# Altium schematic sheet ext_power.SchDoc: External power
size A4; Organization: GPA Robotics; DocumentNumber: 11; Revision: REV 0; SheetNumber: 11; SheetTotal: 11
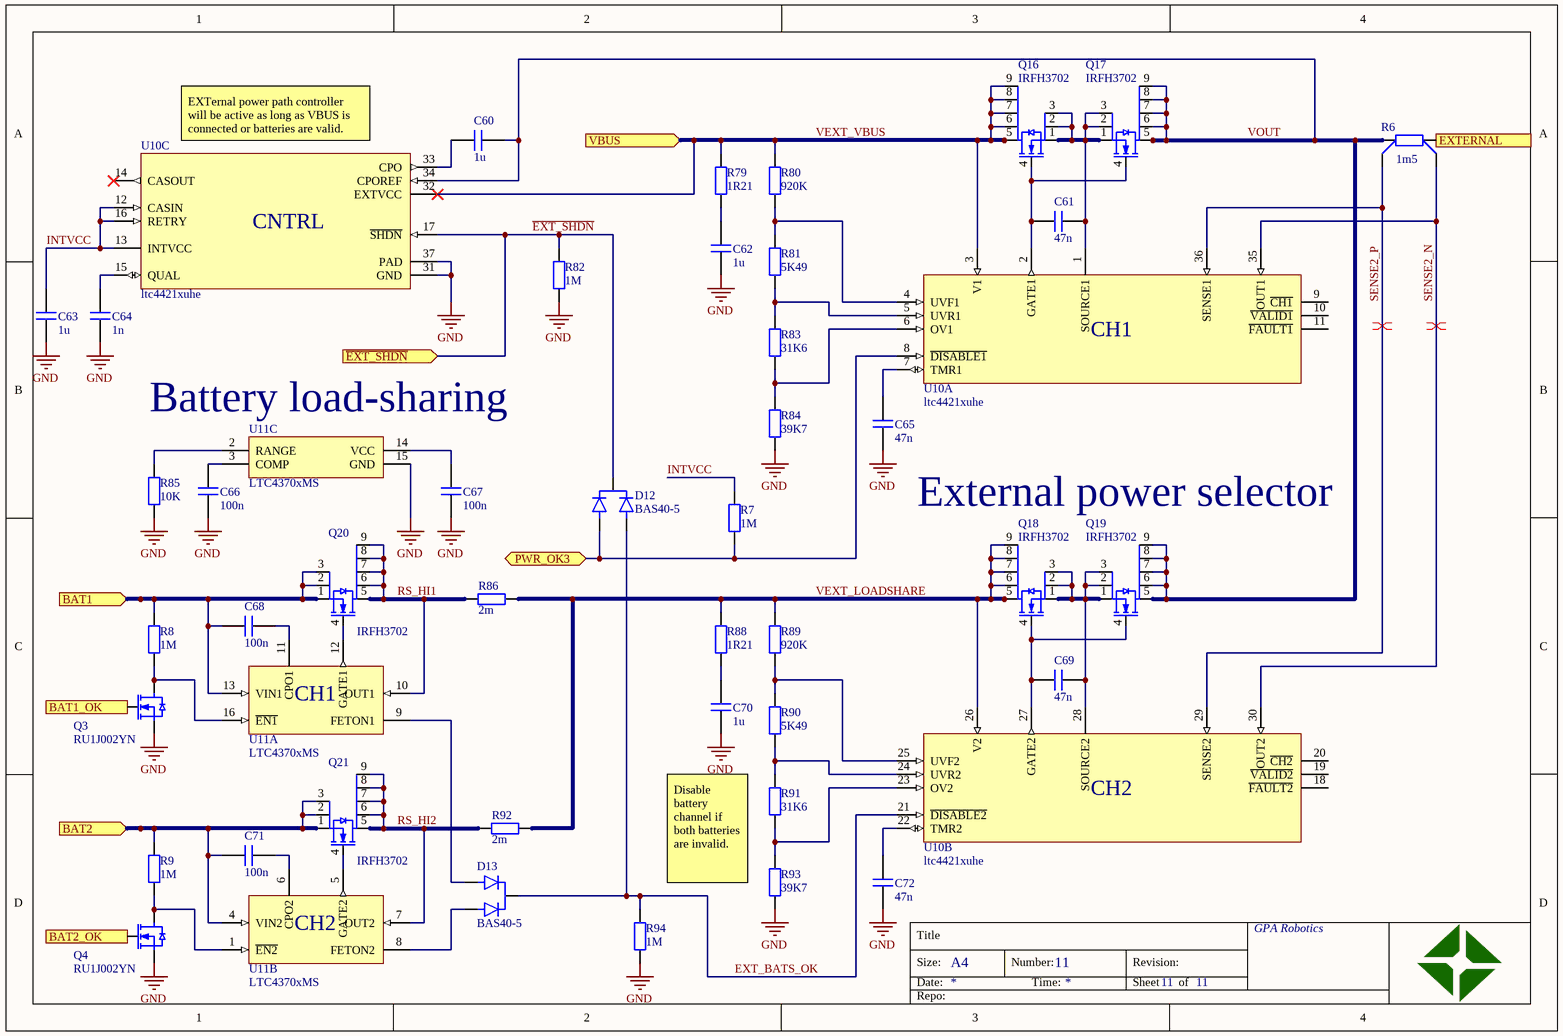
[diagram p0: ext_power.SchDoc]

## Parts
C60  value 1u  [CAPC2012X11N]  (hidden comment: cap)
C61  value 47n  [CAPC1005X06N]  (hidden comment: cap)
C62  value 1u  [CAPC2012X11N]  (hidden comment: cap)
C63  value 1u  [CAPC2012X11N]  (hidden comment: cap)
C64  value 1n  [CAPC1005X06N]  (hidden comment: cap)
C65  value 47n  [CAPC1005X06N]  (hidden comment: cap)
C66  value 100n  [CAPC1005X06N]  (hidden comment: cap)
C67  value 100n  [CAPC1005X06N]  (hidden comment: cap)
C68  value 100n  [CAPC1005X06N]  (hidden comment: cap)
C69  value 47n  [CAPC1005X06N]  (hidden comment: cap)
C70  value 1u  [CAPC2012X11N]  (hidden comment: cap)
C71  value 100n  [CAPC1005X06N]  (hidden comment: cap)
C72  value 47n  [CAPC1005X06N]  (hidden comment: cap)
D12  BAS40-5  [SOT23_CC]
D13  BAS40-5  [SOT23_CC]
Q3  RU1J002YN  [SOTFL65P210X105-3N]
Q4  RU1J002YN  [SOTFL65P210X105-3N]
Q16  IRFH3702  [PQFN67P300X300X100-8N]
Q17  IRFH3702  [PQFN67P300X300X100-8N]
Q18  IRFH3702  [PQFN67P300X300X100-8N]
Q19  IRFH3702  [PQFN67P300X300X100-8N]
Q20  IRFH3702  [PQFN67P300X300X100-8N]
Q21  IRFH3702  [PQFN67P300X300X100-8N]
R6  value 1m5  [4T_RESC1632X05N]  (hidden comment: res_4t)
R7  value 1M  [RESC1005X04N]  (hidden comment: res)
R8  value 1M  [RESC1005X04N]  (hidden comment: res)
R9  value 1M  [RESC1005X04N]  (hidden comment: res)
R79  value 1R21  [RESC2012X06N]  (hidden comment: res)
R80  value 920K  [RESC1005X04N]  (hidden comment: res)
R81  value 5K49  [RESC1005X04N]  (hidden comment: res)
R82  value 1M  [RESC1005X04N]  (hidden comment: res)
R83  value 31K6  [RESC1005X04N]  (hidden comment: res)
R84  value 39K7  [RESC1005X04N]  (hidden comment: res)
R85  value 10K  [RESC1005X04N]  (hidden comment: res)
R86  value 2m  [RESC3216X07N]  (hidden comment: res)
R88  value 1R21  [RESC2012X06N]  (hidden comment: res)
R89  value 920K  [RESC1005X04N]  (hidden comment: res)
R90  value 5K49  [RESC1005X04N]  (hidden comment: res)
R91  value 31K6  [RESC1005X04N]  (hidden comment: res)
R92  value 2m  [RESC3216X07N]  (hidden comment: res)
R93  value 39K7  [RESC1005X04N]  (hidden comment: res)
R94  value 1M  [RESC1005X04N]  (hidden comment: res)
U10  ltc4421xuhe  [QFN50P500X600X80_HS-37N_LTC4421]  (parts A,B,C of 3)
U11  LTC4370xMS  [TSSOP50P510X110-16N_ltc4421]  (parts A,B,C of 3)

## Ports
BAT1 (in), BAT1_OK (in), BAT2 (in), BAT2_OK (in), EXTERNAL (out), PWR_OK3 (bidir), VBUS (in), ~{EXT_SHDN} (in)

## Nets
GND: C62.1 C63.1 C64.1 C65.1 C66.1 C67.1 C70.1 C72.1 Q3.2(S) Q4.2(S) R82.1 R84.1 R85.1 R93.1 R94.1 U10.31(GND) U10.37(PAD) U11.15(GND)
~{EXT_SHDN}: D12.C R82.2 U10.17(~{SHDN}) ; port ~{EXT_SHDN}
BAT1: C68.1 Q20.1(S) Q20.2(S) Q20.3(S) R8.2 U11.13(VIN1) ; port BAT1
BAT1_OK: Q3.1(G) ; port BAT1_OK
BAT2: C71.1 Q21.1(S) Q21.2(S) Q21.3(S) R9.2 U11.4(VIN2) ; port BAT2
BAT2_OK: Q4.1(G) ; port BAT2_OK
EXT_BATS_OK: D12.A1 D13.C R94.2 U10.21(~{DISABLE2})
EXTERNAL: R6.2 ; port EXTERNAL
INTVCC: C63.2 R7.2 U10.12(CASIN) U10.13(INTVCC) U10.16(RETRY)
PWR_OK3: D12.A2 R7.1 U10.8(~{DISABLE1}) ; port PWR_OK3
RS_HI1: Q20.5(D) Q20.6(D) Q20.7(D) Q20.8(D) Q20.9(D) R86.1 U11.10(OUT1)
RS_HI2: Q21.5(D) Q21.6(D) Q21.7(D) Q21.8(D) Q21.9(D) R92.1 U11.7(OUT2)
SENSE2_N: R6.4 U10.30(OUT2) U10.35(OUT1)
SENSE2_P: R6.3 U10.29(SENSE2) U10.36(SENSE1)
VEXT_LOADSHARE: Q18.5(D) Q18.6(D) Q18.7(D) Q18.8(D) Q18.9(D) R86.2 R88.2 R89.2 R92.2 U10.26(V2)
VEXT_VBUS: Q16.5(D) Q16.6(D) Q16.7(D) Q16.8(D) Q16.9(D) R79.2 R80.2 U10.3(V1) U10.32(EXTVCC) ; port VBUS
VOUT: C60.2 Q17.5(D) Q17.6(D) Q17.7(D) Q17.8(D) Q17.9(D) Q19.5(D) Q19.6(D) Q19.7(D) Q19.8(D) Q19.9(D) R6.1 U10.34(CPOREF)
NetC60_1: C60.1 U10.33(CPO)
NetC61_1: C61.1 Q16.4(G) Q17.4(G) U10.2(GATE1)
NetC61_2: C61.2 Q16.1(S) Q16.2(S) Q16.3(S) Q17.1(S) Q17.2(S) Q17.3(S) U10.1(SOURCE1)
NetC62_2: C62.2 R79.1
NetC64_2: C64.2 U10.15(QUAL)
NetC65_2: C65.2 U10.7(TMR1)
NetC66_2: C66.2 U11.3(COMP)
NetC67_2: C67.2 U11.14(VCC)
NetC68_2: C68.2 U11.11(CPO1)
NetC69_1: C69.1 Q18.4(G) Q19.4(G) U10.27(GATE2)
NetC69_2: C69.2 Q18.1(S) Q18.2(S) Q18.3(S) Q19.1(S) Q19.2(S) Q19.3(S) U10.28(SOURCE2)
NetC70_2: C70.2 R88.1
NetC71_2: C71.2 U11.6(CPO2)
NetC72_2: C72.2 U10.22(TMR2)
NetD13_A1: D13.A1 U11.9(FETON1)
NetD13_A2: D13.A2 U11.8(FETON2)
NetQ3_3: Q3.3(D) R8.1 U11.16(~{EN1})
NetQ4_3: Q4.3(D) R9.1 U11.1(~{EN2})
NetQ20_4: Q20.4(G) U11.12(GATE1)
NetQ21_4: Q21.4(G) U11.5(GATE2)
NetR80_1: R80.1 R81.2 U10.4(UVF1)
NetR81_1: R81.1 R83.2 U10.5(UVR1)
NetR83_1: R83.1 R84.2 U10.6(OV1)
NetR85_2: R85.2 U11.2(RANGE)
NetR89_1: R89.1 R90.2 U10.25(UVF2)
NetR90_1: R90.1 R91.2 U10.24(UVR2)
NetR91_1: R91.1 R93.2 U10.23(OV2)

Not connected (* = marked no-connect by the designer): U10 9(~{CH1}) 10(~{VALID1}) 11(~{FAULT1}) 14(CASOUT)* 18(~{FAULT2}) 19(~{VALID2}) 20(~{CH2})

## Layout directives
differential pair: SENSE2_N, SENSE2_P

## Notes on the sheet
- (near U10) EXTernal power path controller will be active as long as VBUS is connected or batteries are valid.
- (near U11) Battery load-sharing
- External power selector
- Disable battery channel if both batteries are invalid.
- Title
- Size:
- Date:
- A4
- Number:
- Time:
- Revision:
- Sheet
- of
- Repo:
- (in symbol ltc4370xms, part A) CH1
- (in symbol ltc4370xms, part B) CH2
- (in symbol ltc4421xuhe, part A) CH1
- (in symbol ltc4421xuhe, part B) CH2
- (in symbol ltc4421xuhe, part C) CNTRL

## Library data of the parts
C60-C72 = cap: Capacitor; voltage: *; type: *; #digikey: *; #mouser: *
D12 D13 = diode_dual_cc: Diode Common Cathode
Q3 Q4 = ru1j002yn: N-channel 50V 200mA Small signal MOSFET; ComponentLink1Description: datasheet; ComponentLink1URL: https://www.mouser.se/datasheet/2/348/ru1j002yn-e-1018335.pdf
Q16-Q21 = irfh3702: HEXFET Power MOSFET; ComponentLink1Description: datasheet; ComponentLink1URL: https://www.infineon.com/dgdl/irfh3702pbf.pdf?fileId=5546d462533600a40153561a25871e76
R6 = res_4t: Resistor; power: *; #digikey: *; #mouser: *
R7-R9 R79-R86 R88-R94 = res: Resistor; power: *; voltage: *; #digikey: *; #mouser: *
U10 = ltc4421xuhe: High Power Prioritized PowerPath Controller; ComponentLink1Description: datasheet; ComponentLink1URL: https://www.analog.com/media/en/technical-documentation/data-sheets/LTC4421.pdf
U11 = ltc4370xms: Two-Supply Diode-OR Current Balancing Controller; ComponentLink1Description: datasheet; ComponentLink1URL: https://www.analog.com/media/en/technical-documentation/data-sheets/4370f.pdf